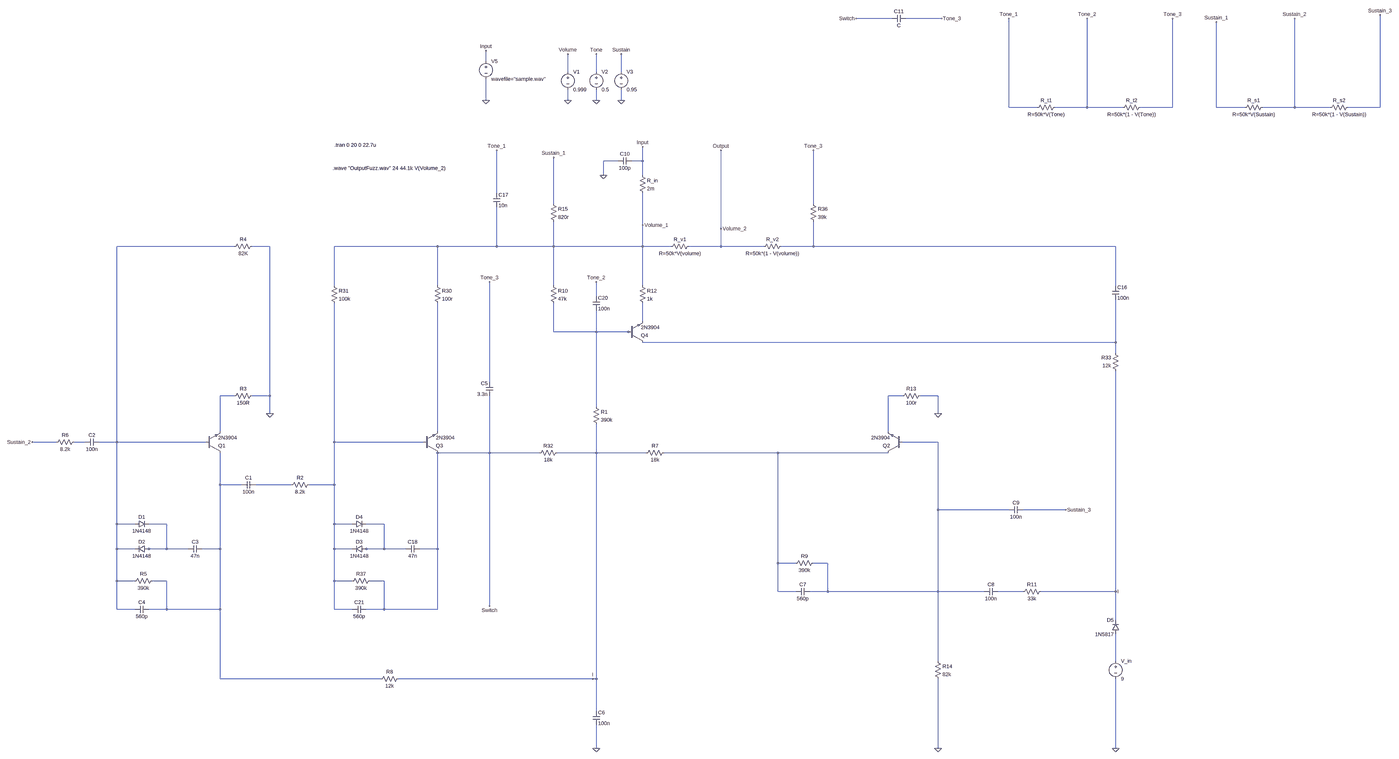
[diagram p0: schematic hizumitas.asc, whole sheet]
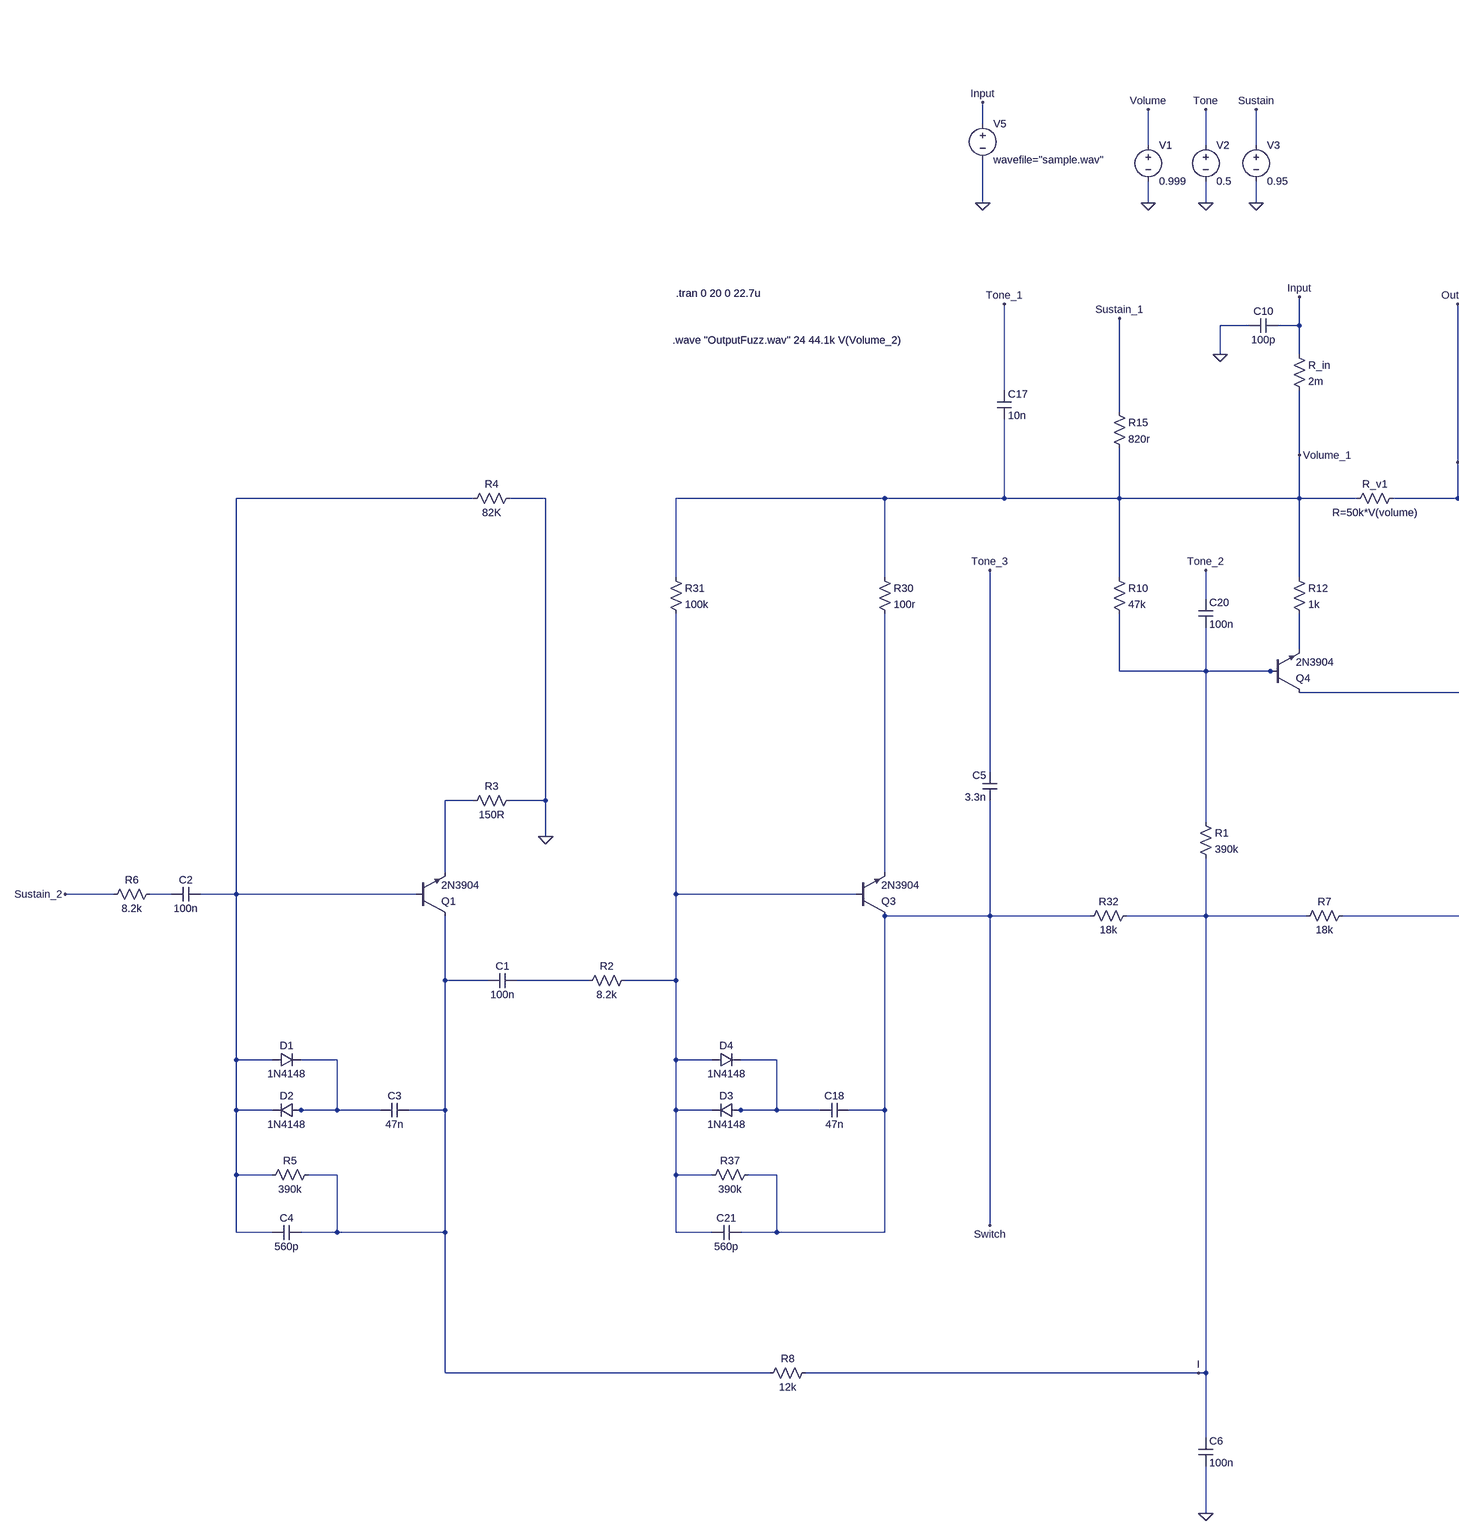
[diagram p1: schematic hizumitas.asc, part, row 1 of 1, column 1 of 2]
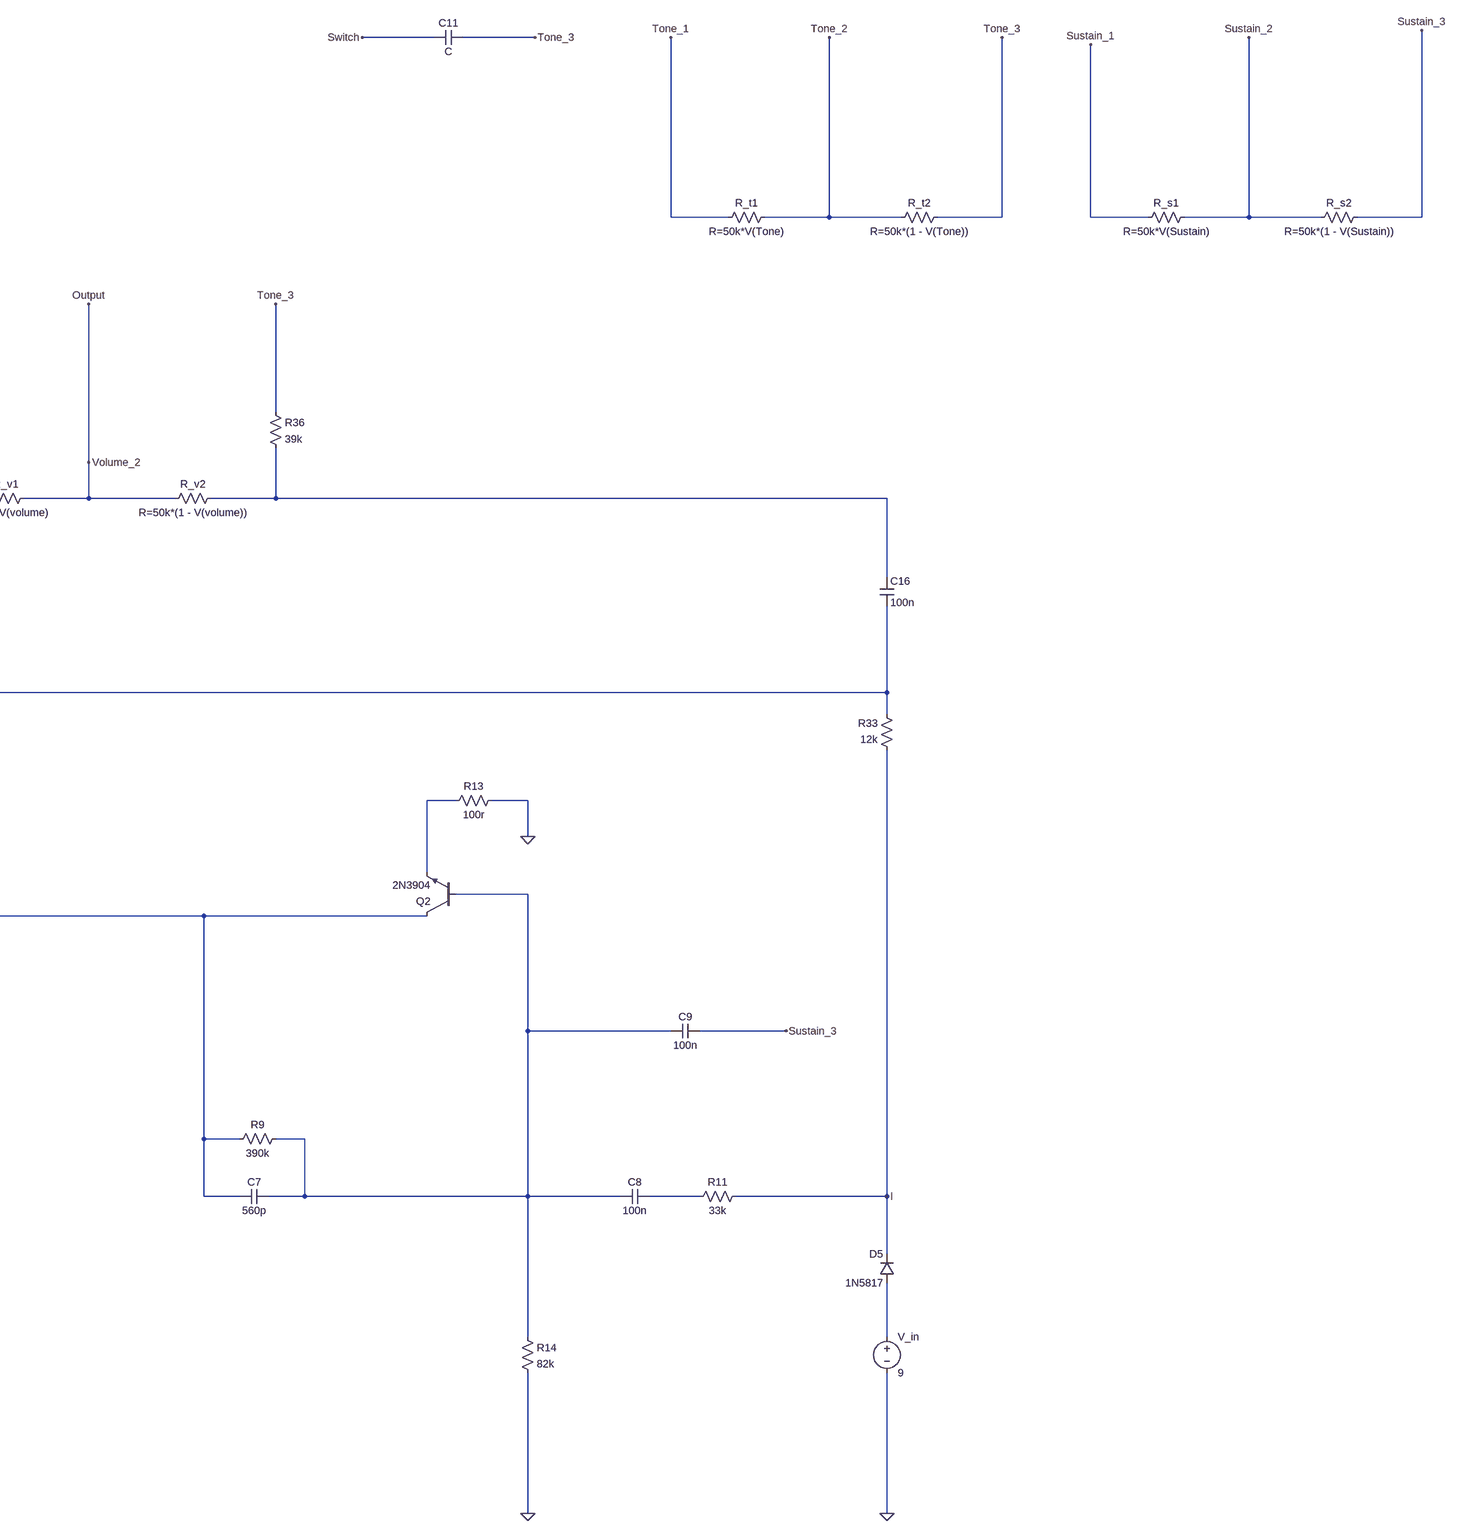
[diagram p2: schematic hizumitas.asc, part, row 1 of 1, column 2 of 2]
hizumitas.asc, the LTspice schematic file:
Version 4.1
SHEET 1 4436 4092
WIRE 1360 -1152 1200 -1152
WIRE 1584 -1152 1424 -1152
WIRE -464 -960 -464 -1008
WIRE -96 -912 -96 -992
WIRE 32 -912 32 -992
WIRE 144 -912 144 -992
WIRE -464 -784 -464 -880
WIRE -96 -784 -96 -832
WIRE 32 -784 32 -832
WIRE 144 -784 144 -832
WIRE 1888 -752 1888 -1152
WIRE 2016 -752 1888 -752
WIRE 2240 -752 2240 -1152
WIRE 2240 -752 2096 -752
WIRE 2400 -752 2240 -752
WIRE 2624 -752 2624 -1152
WIRE 2624 -752 2480 -752
WIRE 2976 -752 2976 -1136
WIRE 3104 -752 2976 -752
WIRE 3328 -752 3328 -1152
WIRE 3328 -752 3184 -752
WIRE 3488 -752 3328 -752
WIRE 3712 -752 3712 -1168
WIRE 3712 -752 3568 -752
WIRE 128 -448 64 -448
WIRE 240 -448 240 -512
WIRE 240 -448 192 -448
WIRE 64 -384 64 -448
WIRE 240 -384 240 -448
WIRE -416 -304 -416 -496
WIRE -160 -256 -160 -464
WIRE 1008 -256 1008 -496
WIRE 240 -160 240 -304
WIRE 592 -144 592 -496
WIRE -1824 -64 -2352 -64
WIRE -1664 -64 -1744 -64
WIRE -880 -64 -1344 -64
WIRE -416 -64 -416 -240
WIRE -416 -64 -880 -64
WIRE -160 -64 -160 -176
WIRE -160 -64 -416 -64
WIRE 240 -64 240 -160
WIRE 240 -64 -160 -64
WIRE 368 -64 240 -64
WIRE 592 -64 592 -144
WIRE 592 -64 448 -64
WIRE 784 -64 592 -64
WIRE 1008 -64 1008 -176
WIRE 1008 -64 864 -64
WIRE 2368 -64 1008 -64
WIRE -1344 112 -1344 -64
WIRE -880 112 -880 -64
WIRE -160 112 -160 -64
WIRE 240 112 240 -64
WIRE 2368 112 2368 -64
WIRE 32 160 32 96
WIRE 240 272 240 192
WIRE -160 320 -160 192
WIRE 32 320 32 224
WIRE 32 320 -160 320
WIRE 176 320 32 320
WIRE 192 320 176 320
WIRE 2368 368 2368 176
WIRE 2368 368 240 368
WIRE 2368 416 2368 368
WIRE -448 544 -448 96
WIRE -1824 608 -1888 608
WIRE -1664 608 -1664 -64
WIRE -1664 608 -1744 608
WIRE 1408 608 1344 608
WIRE 1568 608 1488 608
WIRE 32 656 32 320
WIRE -1664 688 -1664 608
WIRE 1568 688 1568 608
WIRE -1888 768 -1888 608
WIRE -880 768 -880 192
WIRE 1344 768 1344 608
WIRE -2624 816 -2752 816
WIRE -2496 816 -2544 816
WIRE -2352 816 -2352 -64
WIRE -2352 816 -2432 816
WIRE -1952 816 -2352 816
WIRE -1344 816 -1344 192
WIRE -944 816 -1344 816
WIRE 1568 816 1408 816
WIRE -448 864 -448 608
WIRE -448 864 -880 864
WIRE -224 864 -448 864
WIRE 32 864 32 736
WIRE 32 864 -144 864
WIRE 256 864 32 864
WIRE 848 864 336 864
WIRE 1344 864 848 864
WIRE -1888 1008 -1888 864
WIRE -1792 1008 -1888 1008
WIRE -1568 1008 -1728 1008
WIRE -1344 1008 -1344 816
WIRE -1344 1008 -1488 1008
WIRE 1568 1120 1568 816
WIRE 1888 1120 1568 1120
WIRE 2144 1120 1952 1120
WIRE -2352 1184 -2352 816
WIRE -2272 1184 -2352 1184
WIRE -2128 1184 -2208 1184
WIRE -1344 1184 -1344 1008
WIRE -1264 1184 -1344 1184
WIRE -1120 1184 -1200 1184
WIRE -2352 1296 -2352 1184
WIRE -2272 1296 -2352 1296
WIRE -2208 1296 -2224 1296
WIRE -2128 1296 -2128 1184
WIRE -2128 1296 -2208 1296
WIRE -2032 1296 -2128 1296
WIRE -1888 1296 -1888 1008
WIRE -1888 1296 -1968 1296
WIRE -1344 1296 -1344 1184
WIRE -1264 1296 -1344 1296
WIRE -1200 1296 -1216 1296
WIRE -1120 1296 -1120 1184
WIRE -1120 1296 -1200 1296
WIRE -1024 1296 -1120 1296
WIRE -880 1296 -880 864
WIRE -880 1296 -960 1296
WIRE 848 1360 848 864
WIRE 928 1360 848 1360
WIRE 1072 1360 1008 1360
WIRE -2352 1440 -2352 1296
WIRE -2272 1440 -2352 1440
WIRE -2128 1440 -2192 1440
WIRE -1344 1440 -1344 1296
WIRE -1264 1440 -1344 1440
WIRE -1120 1440 -1184 1440
WIRE 848 1488 848 1360
WIRE 928 1488 848 1488
WIRE 1072 1488 1072 1360
WIRE 1072 1488 992 1488
WIRE 1568 1488 1568 1120
WIRE 1568 1488 1072 1488
WIRE 1776 1488 1568 1488
WIRE 1952 1488 1840 1488
WIRE 2368 1488 2368 496
WIRE 2368 1488 2032 1488
WIRE -448 1552 -448 864
WIRE -2352 1568 -2352 1440
WIRE -2272 1568 -2352 1568
WIRE -2128 1568 -2128 1440
WIRE -2128 1568 -2208 1568
WIRE -1888 1568 -1888 1296
WIRE -1888 1568 -2128 1568
WIRE -1344 1568 -1344 1440
WIRE -1264 1568 -1344 1568
WIRE -1120 1568 -1120 1440
WIRE -1120 1568 -1200 1568
WIRE -880 1568 -880 1296
WIRE -880 1568 -1120 1568
WIRE 2368 1616 2368 1488
WIRE 1568 1952 1568 1488
WIRE 2368 1952 2368 1680
WIRE -1888 2032 -1888 1568
WIRE -1136 2032 -1888 2032
WIRE 16 2032 -1056 2032
WIRE 32 2032 32 864
WIRE 32 2032 16 2032
WIRE 32 2224 32 2032
WIRE 32 2416 32 2288
WIRE 1568 2416 1568 2032
WIRE 2368 2416 2368 2032
FLAG -96 -784 0
FLAG -96 -992 Volume
FLAG 32 -784 0
FLAG 32 -992 Tone
FLAG 144 -784 0
FLAG 144 -992 Sustain
FLAG 240 -512 Input
FLAG -464 -1008 Input
FLAG -464 -784 0
FLAG 592 -496 Output
FLAG 240 -160 Volume_1
FLAG 592 -144 Volume_2
FLAG 2240 -1152 Tone_2
FLAG 2368 2416 0
FLAG 3328 -1152 Sustain_2
FLAG 3712 -1168 Sustain_3
FLAG 32 96 Tone_2
FLAG -1664 688 0
FLAG -2752 816 Sustain_2
FLAG -448 1552 Switch
FLAG -448 96 Tone_3
FLAG 32 2416 0
FLAG 16 2032 I
FLAG 1568 688 0
FLAG 1568 2416 0
FLAG 2144 1120 Sustain_3
FLAG 2976 -1136 Sustain_1
FLAG -160 -464 Sustain_1
FLAG 2624 -1152 Tone_3
FLAG 1008 -496 Tone_3
FLAG 1888 -1152 Tone_1
FLAG -416 -496 Tone_1
FLAG 64 -384 0
FLAG 2368 1488 I
FLAG 1200 -1152 Switch
FLAG 1584 -1152 Tone_3
SYMBOL res 880 -80 R90
WINDOW 0 0 56 VBottom 2
WINDOW 3 32 56 VTop 2
SYMATTR InstName R_v2
SYMATTR Value R=50k*(1 - V(volume))
SYMBOL res 464 -80 R90
WINDOW 0 0 56 VBottom 2
WINDOW 3 32 56 VTop 2
SYMATTR InstName R_v1
SYMATTR Value R=50k*V(volume)
SYMBOL voltage -96 -928 R0
WINDOW 123 0 0 Left 0
WINDOW 39 0 0 Left 0
SYMATTR InstName V1
SYMATTR Value 0.999
SYMBOL voltage 32 -928 R0
WINDOW 123 0 0 Left 0
WINDOW 39 0 0 Left 0
SYMATTR InstName V2
SYMATTR Value 0.5
SYMBOL voltage 144 -928 R0
WINDOW 123 0 0 Left 0
WINDOW 39 0 0 Left 0
SYMATTR InstName V3
SYMATTR Value 0.95
SYMBOL voltage -464 -976 R0
WINDOW 123 0 0 Left 0
WINDOW 39 0 0 Left 0
SYMATTR InstName V5
SYMATTR Value wavefile="sample.wav"
SYMBOL res 224 -400 R0
SYMATTR InstName R_in
SYMATTR Value 2m
SYMBOL npn 176 368 M180
SYMATTR InstName Q4
SYMATTR Value 2N3904
SYMBOL res 224 96 R0
SYMATTR InstName R12
SYMATTR Value 1k
SYMBOL res -176 96 R0
SYMATTR InstName R10
SYMATTR Value 47k
SYMBOL cap 2352 112 R0
SYMATTR InstName C16
SYMATTR Value 100n
SYMBOL res 2496 -768 R90
WINDOW 0 0 56 VBottom 2
WINDOW 3 32 56 VTop 2
SYMATTR InstName R_t2
SYMATTR Value R=50k*(1 - V(Tone))
SYMBOL res 2112 -768 R90
WINDOW 0 0 56 VBottom 2
WINDOW 3 32 56 VTop 2
SYMATTR InstName R_t1
SYMATTR Value R=50k*V(Tone)
SYMBOL cap -432 -304 R0
SYMATTR InstName C17
SYMATTR Value 10n
SYMBOL npn -944 864 M180
SYMATTR InstName Q3
SYMATTR Value 2N3904
SYMBOL res -896 96 R0
SYMATTR InstName R30
SYMATTR Value 100r
SYMBOL res -1360 96 R0
SYMATTR InstName R31
SYMATTR Value 100k
SYMBOL diode -1264 1168 M90
WINDOW 0 0 32 VBottom 2
WINDOW 3 32 32 VTop 2
SYMATTR InstName D4
SYMATTR Value 1N4148
SYMBOL diode -1200 1280 R90
WINDOW 0 0 32 VBottom 2
WINDOW 3 32 32 VTop 2
SYMATTR InstName D3
SYMATTR Value 1N4148
SYMBOL cap -1024 1312 R270
WINDOW 0 32 32 VTop 2
WINDOW 3 0 32 VBottom 2
SYMATTR InstName C18
SYMATTR Value 47n
SYMBOL diode 2384 1680 R180
WINDOW 0 24 64 Left 2
WINDOW 3 24 0 Left 2
SYMATTR InstName D5
SYMATTR Value 1N5817
SYMBOL voltage 2368 1936 R0
WINDOW 123 0 0 Left 0
WINDOW 39 0 0 Left 0
SYMATTR InstName V_in
SYMATTR Value 9
SYMBOL res -128 848 R90
WINDOW 0 0 56 VBottom 2
WINDOW 3 32 56 VTop 2
SYMATTR InstName R32
SYMATTR Value 18k
SYMBOL res 2384 512 R180
WINDOW 0 36 76 Left 2
WINDOW 3 36 40 Left 2
SYMATTR InstName R33
SYMATTR Value 12k
SYMBOL res 3584 -768 R90
WINDOW 0 0 56 VBottom 2
WINDOW 3 32 56 VTop 2
SYMATTR InstName R_s2
SYMATTR Value R=50k*(1 - V(Sustain))
SYMBOL res 3200 -768 R90
WINDOW 0 0 56 VBottom 2
WINDOW 3 32 56 VTop 2
SYMATTR InstName R_s1
SYMATTR Value R=50k*V(Sustain)
SYMBOL res 992 -272 R0
SYMATTR InstName R36
SYMATTR Value 39k
SYMBOL cap 16 160 R0
SYMATTR InstName C20
SYMATTR Value 100n
SYMBOL res -1168 1424 R90
WINDOW 0 0 56 VBottom 2
WINDOW 3 32 56 VTop 2
SYMATTR InstName R37
SYMATTR Value 390k
SYMBOL cap -1200 1552 R90
WINDOW 0 0 32 VBottom 2
WINDOW 3 32 32 VTop 2
SYMATTR InstName C21
SYMATTR Value 560p
SYMBOL res 16 640 R0
SYMATTR InstName R1
SYMATTR Value 390k
SYMBOL res -1472 992 R90
WINDOW 0 0 56 VBottom 2
WINDOW 3 32 56 VTop 2
SYMATTR InstName R2
SYMATTR Value 8.2k
SYMBOL cap -1728 992 R90
WINDOW 0 0 32 VBottom 2
WINDOW 3 32 32 VTop 2
SYMATTR InstName C1
SYMATTR Value 100n
SYMBOL npn -1952 864 M180
SYMATTR InstName Q1
SYMATTR Value 2N3904
SYMBOL diode -2272 1168 M90
WINDOW 0 0 32 VBottom 2
WINDOW 3 32 32 VTop 2
SYMATTR InstName D1
SYMATTR Value 1N4148
SYMBOL diode -2208 1280 R90
WINDOW 0 0 32 VBottom 2
WINDOW 3 32 32 VTop 2
SYMATTR InstName D2
SYMATTR Value 1N4148
SYMBOL cap -2032 1312 R270
WINDOW 0 32 32 VTop 2
WINDOW 3 0 32 VBottom 2
SYMATTR InstName C3
SYMATTR Value 47n
SYMBOL res -2176 1424 R90
WINDOW 0 0 56 VBottom 2
WINDOW 3 32 56 VTop 2
SYMATTR InstName R5
SYMATTR Value 390k
SYMBOL cap -2208 1552 R90
WINDOW 0 0 32 VBottom 2
WINDOW 3 32 32 VTop 2
SYMATTR InstName C4
SYMATTR Value 560p
SYMBOL res -1728 592 R90
WINDOW 0 0 56 VBottom 2
WINDOW 3 32 56 VTop 2
SYMATTR InstName R3
SYMATTR Value 150R
SYMBOL res -1728 -80 R90
WINDOW 0 0 56 VBottom 2
WINDOW 3 32 56 VTop 2
SYMATTR InstName R4
SYMATTR Value 82K
SYMBOL cap -2432 800 R90
WINDOW 0 0 32 VBottom 2
WINDOW 3 32 32 VTop 2
SYMATTR InstName C2
SYMATTR Value 100n
SYMBOL res -2528 800 R90
WINDOW 0 0 56 VBottom 2
WINDOW 3 32 56 VTop 2
SYMATTR InstName R6
SYMATTR Value 8.2k
SYMBOL cap -432 608 R180
WINDOW 0 24 56 Left 2
WINDOW 3 24 8 Left 2
SYMATTR InstName C5
SYMATTR Value 3.3n
SYMBOL cap 16 2224 R0
SYMATTR InstName C6
SYMATTR Value 100n
SYMBOL npn 1408 864 R180
SYMATTR InstName Q2
SYMATTR Value 2N3904
SYMBOL res 352 848 R90
WINDOW 0 0 56 VBottom 2
WINDOW 3 32 56 VTop 2
SYMATTR InstName R7
SYMATTR Value 18k
SYMBOL res -1040 2016 R90
WINDOW 0 0 56 VBottom 2
WINDOW 3 32 56 VTop 2
SYMATTR InstName R8
SYMATTR Value 12k
SYMBOL res 1024 1344 R90
WINDOW 0 0 56 VBottom 2
WINDOW 3 32 56 VTop 2
SYMATTR InstName R9
SYMATTR Value 390k
SYMBOL cap 992 1472 R90
WINDOW 0 0 32 VBottom 2
WINDOW 3 32 32 VTop 2
SYMATTR InstName C7
SYMATTR Value 560p
SYMBOL cap 1840 1472 R90
WINDOW 0 0 32 VBottom 2
WINDOW 3 32 32 VTop 2
SYMATTR InstName C8
SYMATTR Value 100n
SYMBOL res 2048 1472 R90
WINDOW 0 0 56 VBottom 2
WINDOW 3 32 56 VTop 2
SYMATTR InstName R11
SYMATTR Value 33k
SYMBOL res 1504 592 R90
WINDOW 0 0 56 VBottom 2
WINDOW 3 32 56 VTop 2
SYMATTR InstName R13
SYMATTR Value 100r
SYMBOL res 1552 1936 R0
SYMATTR InstName R14
SYMATTR Value 82k
SYMBOL cap 1952 1104 R90
WINDOW 0 0 32 VBottom 2
WINDOW 3 32 32 VTop 2
SYMATTR InstName C9
SYMATTR Value 100n
SYMBOL res -176 -272 R0
SYMATTR InstName R15
SYMATTR Value 820r
SYMBOL cap 192 -464 R90
WINDOW 0 0 32 VBottom 2
WINDOW 3 32 32 VTop 2
SYMATTR InstName C10
SYMATTR Value 100p
SYMBOL cap 1424 -1168 R90
WINDOW 0 0 32 VBottom 2
WINDOW 3 32 32 VTop 2
SYMATTR InstName C11
TEXT -1344 -520 Left 2 !.tran 0 20 0 22.7u
TEXT -1352 -416 Left 2 !.wave "OutputFuzz.wav" 24 44.1k V(Volume_2)

The netlist it stands for:
* hizumitas.asc
R_v2 N002 Volume_2 R=50k*(1 - V(volume))
R_v1 Volume_2 Volume_1 R=50k*V(volume)
V1 Volume 0 0.999
V2 Tone 0 0.5
V3 Sustain 0 0.95
V5 Input 0 wavefile="sample.wav"
R_in Input Volume_1 2m
Q4 N005 N004 N003 0 2N3904
R12 Volume_1 N003 1k
R10 Volume_1 N004 47k
C16 N002 N005 100n
R_t2 Tone_3 Tone_2 R=50k*(1 - V(Tone))
R_t1 Tone_2 Tone_1 R=50k*V(Tone)
C17 Tone_1 Volume_1 10n
Q3 Switch N010 N008 0 2N3904
R30 Volume_1 N008 100r
R31 Volume_1 N010 100k
D4 N010 N016 1N4148
D3 N016 N010 1N4148
C18 N016 Switch 47n
D5 N018 I 1N5817
V_in N018 0 9
R32 I Switch 18k
R33 I N005 12k
R_s2 Sustain_3 Sustain_2 R=50k*(1 - V(Sustain))
R_s1 Sustain_2 Sustain_1 R=50k*V(Sustain)
R36 Tone_3 N002 39k
C20 Tone_2 N004 100n
R37 Switch N010 390k
C21 Switch N010 560p
R1 N004 I 390k
R2 N010 N014 8.2k
C1 N014 N013 100n
Q1 N013 N001 N006 0 2N3904
D1 N001 N015 1N4148
D2 N015 N001 1N4148
C3 N015 N013 47n
R5 N013 N001 390k
C4 N013 N001 560p
R3 0 N006 150R
R4 0 N001 82K
C2 N001 N009 100n
R6 N009 Sustain_2 8.2k
C5 Switch Tone_3 3.3n
C6 I 0 100n
Q2 N012 N011 N007 0 2N3904
R7 N012 I 18k
R8 I N013 12k
R9 N011 N012 390k
C7 N011 N012 560p
C8 N017 N011 100n
R11 I N017 33k
R13 0 N007 100r
R14 N011 0 82k
C9 Sustain_3 N011 100n
R15 Sustain_1 Volume_1 820r
C10 Input 0 100p
C11 Tone_3 Switch C
.model D D
.lib standard.dio
.model NPN NPN
.model PNP PNP
.lib standard.bjt
.tran 0 20 0 22.7u
.wave "OutputFuzz.wav" 24 44.1k V(Volume_2)
.backanno
.end